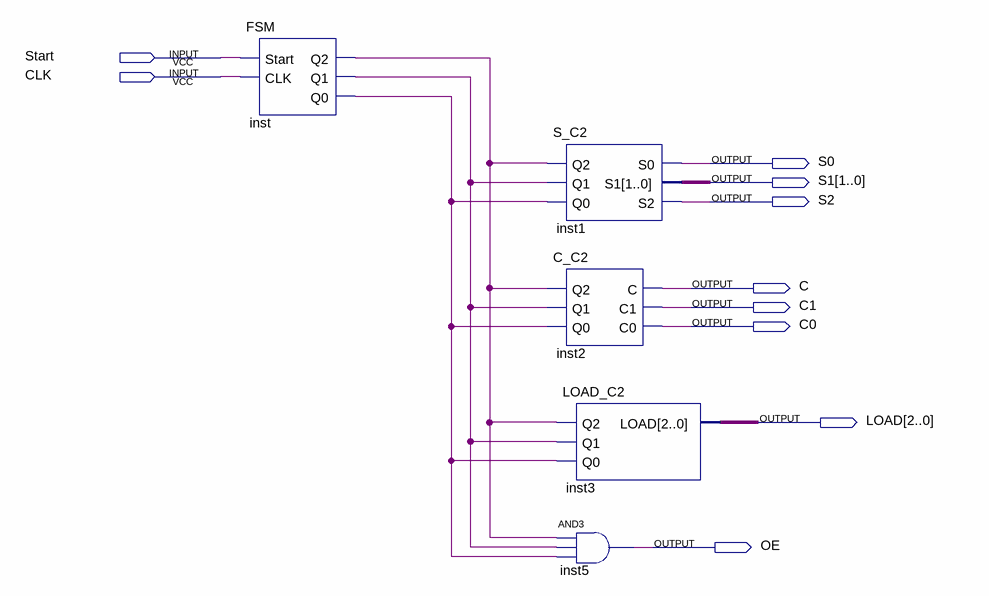
[diagram p0: schematic sheet]
// Quartus schematic controller2.bdf as structural Verilog: 5 symbols, 10 pins
module controller2 (
  input  Start,
  input  CLK,
  output S0,
  output [1:0] S1,
  output S2,
  output C,
  output C1,
  output C0,
  output [2:0] LOAD,
  output OE
);

  wire inst_q0, inst_q1, inst_q2;

  FSM inst (.Start(Start), .CLK(CLK), .Q2(inst_q2), .Q1(inst_q1), .Q0(inst_q0));
  S_C2 inst1 (.Q2(inst_q2), .Q1(inst_q1), .Q0(inst_q0), .S0(S0), .S1(S1), .S2(S2));
  C_C2 inst2 (.Q2(inst_q2), .Q1(inst_q1), .Q0(inst_q0), .C(C), .C1(C1), .C0(C0));
  LOAD_C2 inst3 (.Q2(inst_q2), .Q1(inst_q1), .Q0(inst_q0), .LOAD(LOAD));
  and inst5 (OE, inst_q2, inst_q1, inst_q0);
endmodule
